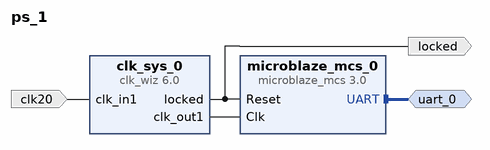
[diagram p0: block diagram of the top level]
# Vivado block design ps_1, xc7k160tffg676-2, Vivado 2024.2
create_bd_design ps_1

create_bd_intf_port -mode Master -vlnv xilinx.com:interface:uart_rtl:1.0 uart_0
create_bd_port -dir O locked
create_bd_port -dir I -type clk clk20
set_property -dict {CONFIG.FREQ_HZ 20000000} [get_bd_ports clk20]

create_bd_cell -type ip -vlnv xilinx.com:ip:clk_wiz:6.0 clk_sys_0
set_property -dict {CONFIG.USE_RESET false} [get_bd_cells clk_sys_0]
create_bd_cell -type ip -vlnv xilinx.com:ip:microblaze_mcs:3.0 microblaze_mcs_0
set_property -dict [list \
  CONFIG.DEBUG_ENABLED 1 \
  CONFIG.MEMSIZE 24576 \
  CONFIG.TRACE 0 \
  CONFIG.UART_BAUDRATE 115200 \
  CONFIG.USE_FIT1 1 \
  CONFIG.USE_UART_TX 1 \
] [get_bd_cells microblaze_mcs_0]

# ---- connections ----

connect_bd_intf_net [get_bd_intf_ports uart_0] [get_bd_intf_pins microblaze_mcs_0/UART]
connect_bd_net -net clk20_1 [get_bd_ports clk20] [get_bd_pins clk_sys_0/clk_in1]
connect_bd_net [get_bd_pins clk_sys_0/clk_out1] [get_bd_pins microblaze_mcs_0/Clk]
connect_bd_net [get_bd_pins clk_sys_0/locked] [get_bd_ports locked] [get_bd_pins microblaze_mcs_0/Reset]

validate_bd_design
save_bd_design
